# Altium schematic sheet SOM_JX_MIO.SchDoc
size A3; SheetNumber: 3; SheetTotal: 13
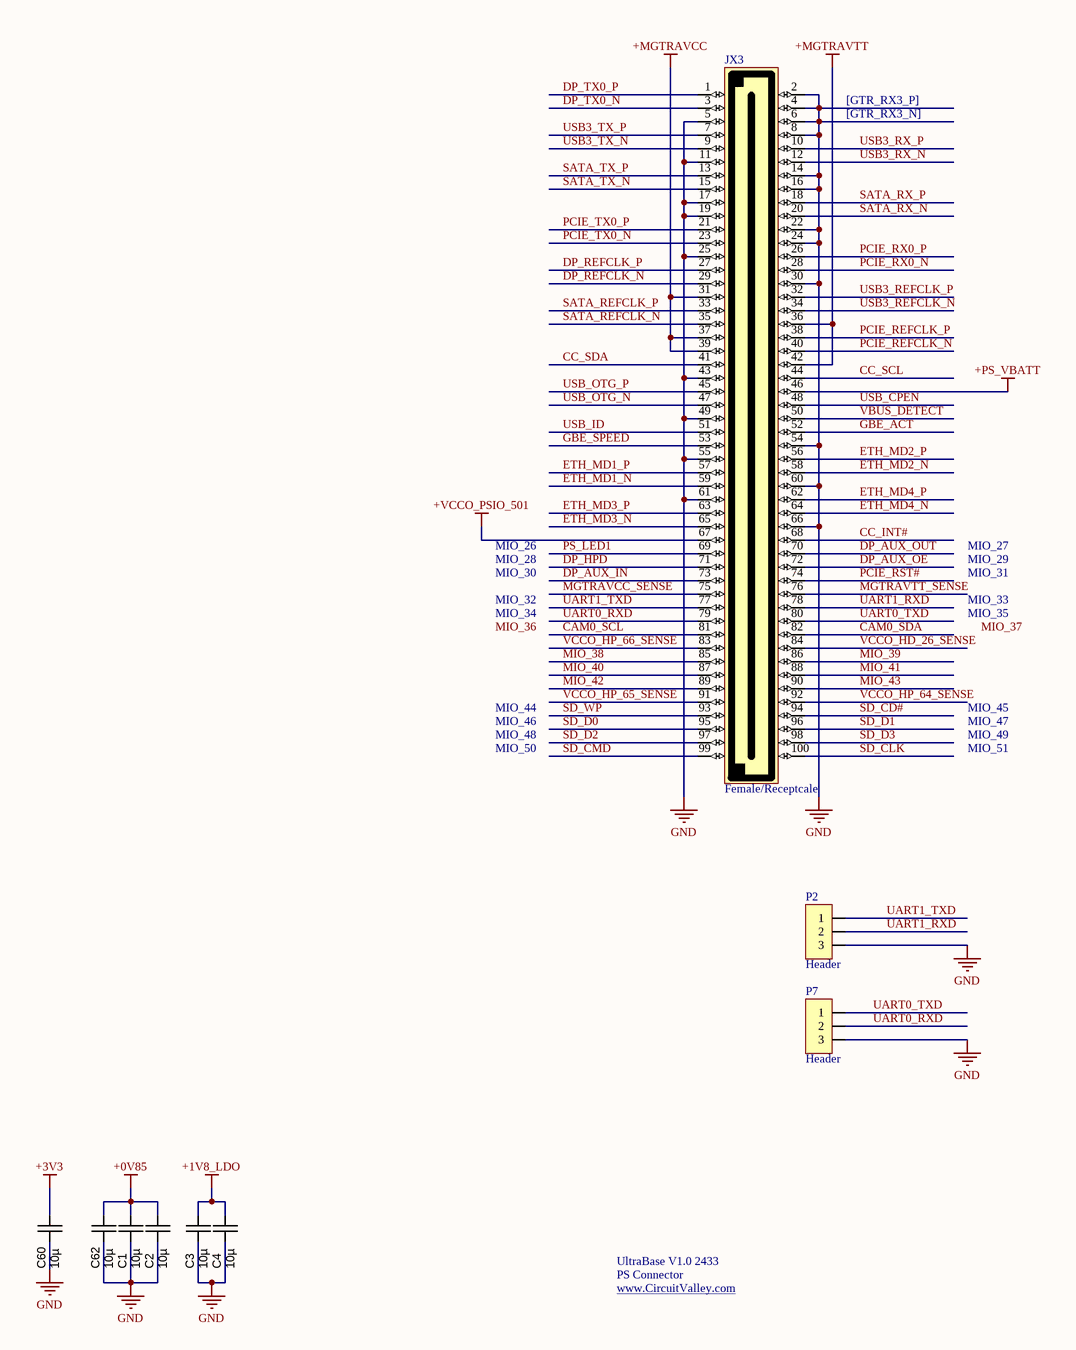
[diagram p0: SOM_JX_MIO.SchDoc]

## Parts
C1  10µ  [CAPC3225N]
C2  10µ  [CAPC3225N]
C3  10µ  [CAPC3225N]
C4  10µ  [CAPC3225N]
C60  10µ  [CAPC3225N]
C62  10µ  [CAPC3225N]
JX3  Female/Receptcale  [5177985-4]
P2  Header  [Header3x]
P7  Header  [Header3x]

## Nets
+0V85: C1.1 C2.1 C62.1
+1V8_LDO: C3.1 C4.1
+3V3: C60.1
+MGTRAVCC: JX3.31 JX3.37 JX3.39
+MGTRAVTT: JX3.36 JX3.42
+PS_VBATT: JX3.46
+VCCO_PSIO_501: JX3.67
GND: C1.2 C2.2 C3.2 C4.2 C60.2 C62.2 JX3.2 JX3.4 JX3.5 JX3.6 JX3.8 JX3.11 JX3.14 JX3.16 JX3.17 JX3.19 JX3.22 JX3.24 JX3.25 JX3.30 JX3.43 JX3.49 JX3.54 JX3.55 JX3.60 JX3.61 JX3.66 P2.3 P7.3
CAM0_SCL: JX3.81
CAM0_SDA: JX3.82
CC_INT#: JX3.68
CC_SCL: JX3.44
CC_SDA: JX3.41
DP_AUX_IN: JX3.73
DP_AUX_OE: JX3.72
DP_AUX_OUT: JX3.70
DP_HPD: JX3.71
DP_REFCLK_N: JX3.29
DP_REFCLK_P: JX3.27
DP_TX0_N: JX3.3
DP_TX0_P: JX3.1
ETH_MD1_N: JX3.59
ETH_MD1_P: JX3.57
ETH_MD2_N: JX3.58
ETH_MD2_P: JX3.56
ETH_MD3_N: JX3.65
ETH_MD3_P: JX3.63
ETH_MD4_N: JX3.64
ETH_MD4_P: JX3.62
GBE_ACT: JX3.52
GBE_SPEED: JX3.53
MGTRAVCC_SENSE: JX3.75
MGTRAVTT_SENSE: JX3.76
MIO_38: JX3.85
MIO_39: JX3.86
MIO_40: JX3.87
MIO_41: JX3.88
MIO_42: JX3.89
MIO_43: JX3.90
PCIE_REFCLK_N: JX3.40
PCIE_REFCLK_P: JX3.38
PCIE_RST#: JX3.74
PCIE_RX0_N: JX3.28
PCIE_RX0_P: JX3.26
PCIE_TX0_N: JX3.23
PCIE_TX0_P: JX3.21
PS_LED1: JX3.69
SATA_REFCLK_N: JX3.35
SATA_REFCLK_P: JX3.33
SATA_RX_N: JX3.20
SATA_RX_P: JX3.18
SATA_TX_N: JX3.15
SATA_TX_P: JX3.13
SD_CD#: JX3.94
SD_CLK: JX3.100
SD_CMD: JX3.99
SD_D0: JX3.95
SD_D1: JX3.96
SD_D2: JX3.97
SD_D3: JX3.98
SD_WP: JX3.93
UART0_RXD: JX3.79 P7.2
UART0_TXD: JX3.80 P7.1
UART1_RXD: JX3.78 P2.2
UART1_TXD: JX3.77 P2.1
USB3_REFCLK_N: JX3.34
USB3_REFCLK_P: JX3.32
USB3_RX_N: JX3.12
USB3_RX_P: JX3.10
USB3_TX_N: JX3.9
USB3_TX_P: JX3.7
USB_CPEN: JX3.48
USB_ID: JX3.51
USB_OTG_N: JX3.47
USB_OTG_P: JX3.45
VBUS_DETECT: JX3.50
VCCO_HD_26_SENSE: JX3.84
VCCO_HP_64_SENSE: JX3.92
VCCO_HP_65_SENSE: JX3.91
VCCO_HP_66_SENSE: JX3.83

## Notes on the sheet
- [GTR_RX3_P]
- [GTR_RX3_N]
- MIO_32
- MIO_26
- MIO_28
- MIO_30
- MIO_33
- MIO_31
- MIO_29
- MIO_27
- MIO_34
- MIO_35
- MIO_48
- MIO_46
- MIO_44
- MIO_45
- MIO_47
- MIO_49
- MIO_50
- MIO_51
- UltraBase V1.0 2433
- PS Connector
- www.CircuitValley.com <http://www.CircuitValley.com>
- Labels drawn without touching a wire or pin: MIO_36, MIO_37

## Library data of the parts
C1-C4 C60 C62 = CAPC_10u_1210_50V: Capacitor SMD Cer 10uF 20% 16V X5R 1210; Manufacturer 1: Taiyo Yuden; Manufacturer Part Number 1: UMK325BJ106MM-T; Ratings: 50V; X5R; Material: ceramic; Package / Case: 1210 (3225 Metric); Tolerance: ±20%; Size / Dimension: 0.126" L x 0.098" W (3.20mm x 2.50mm); Supplier 1: Digi-Key; Supplier Part Number 1: 587-2225-1-ND; Value: 10µ
JX3 = 5177985-4_Ultrazed: 100 Pin Ultrascale  SOM Connector with ultrazed specific SOM net delay
P2 P7 = Header_3Pin: 3 Pin Header